# Altium project LCD-Controller.PrjPCB (part 1 of 2)
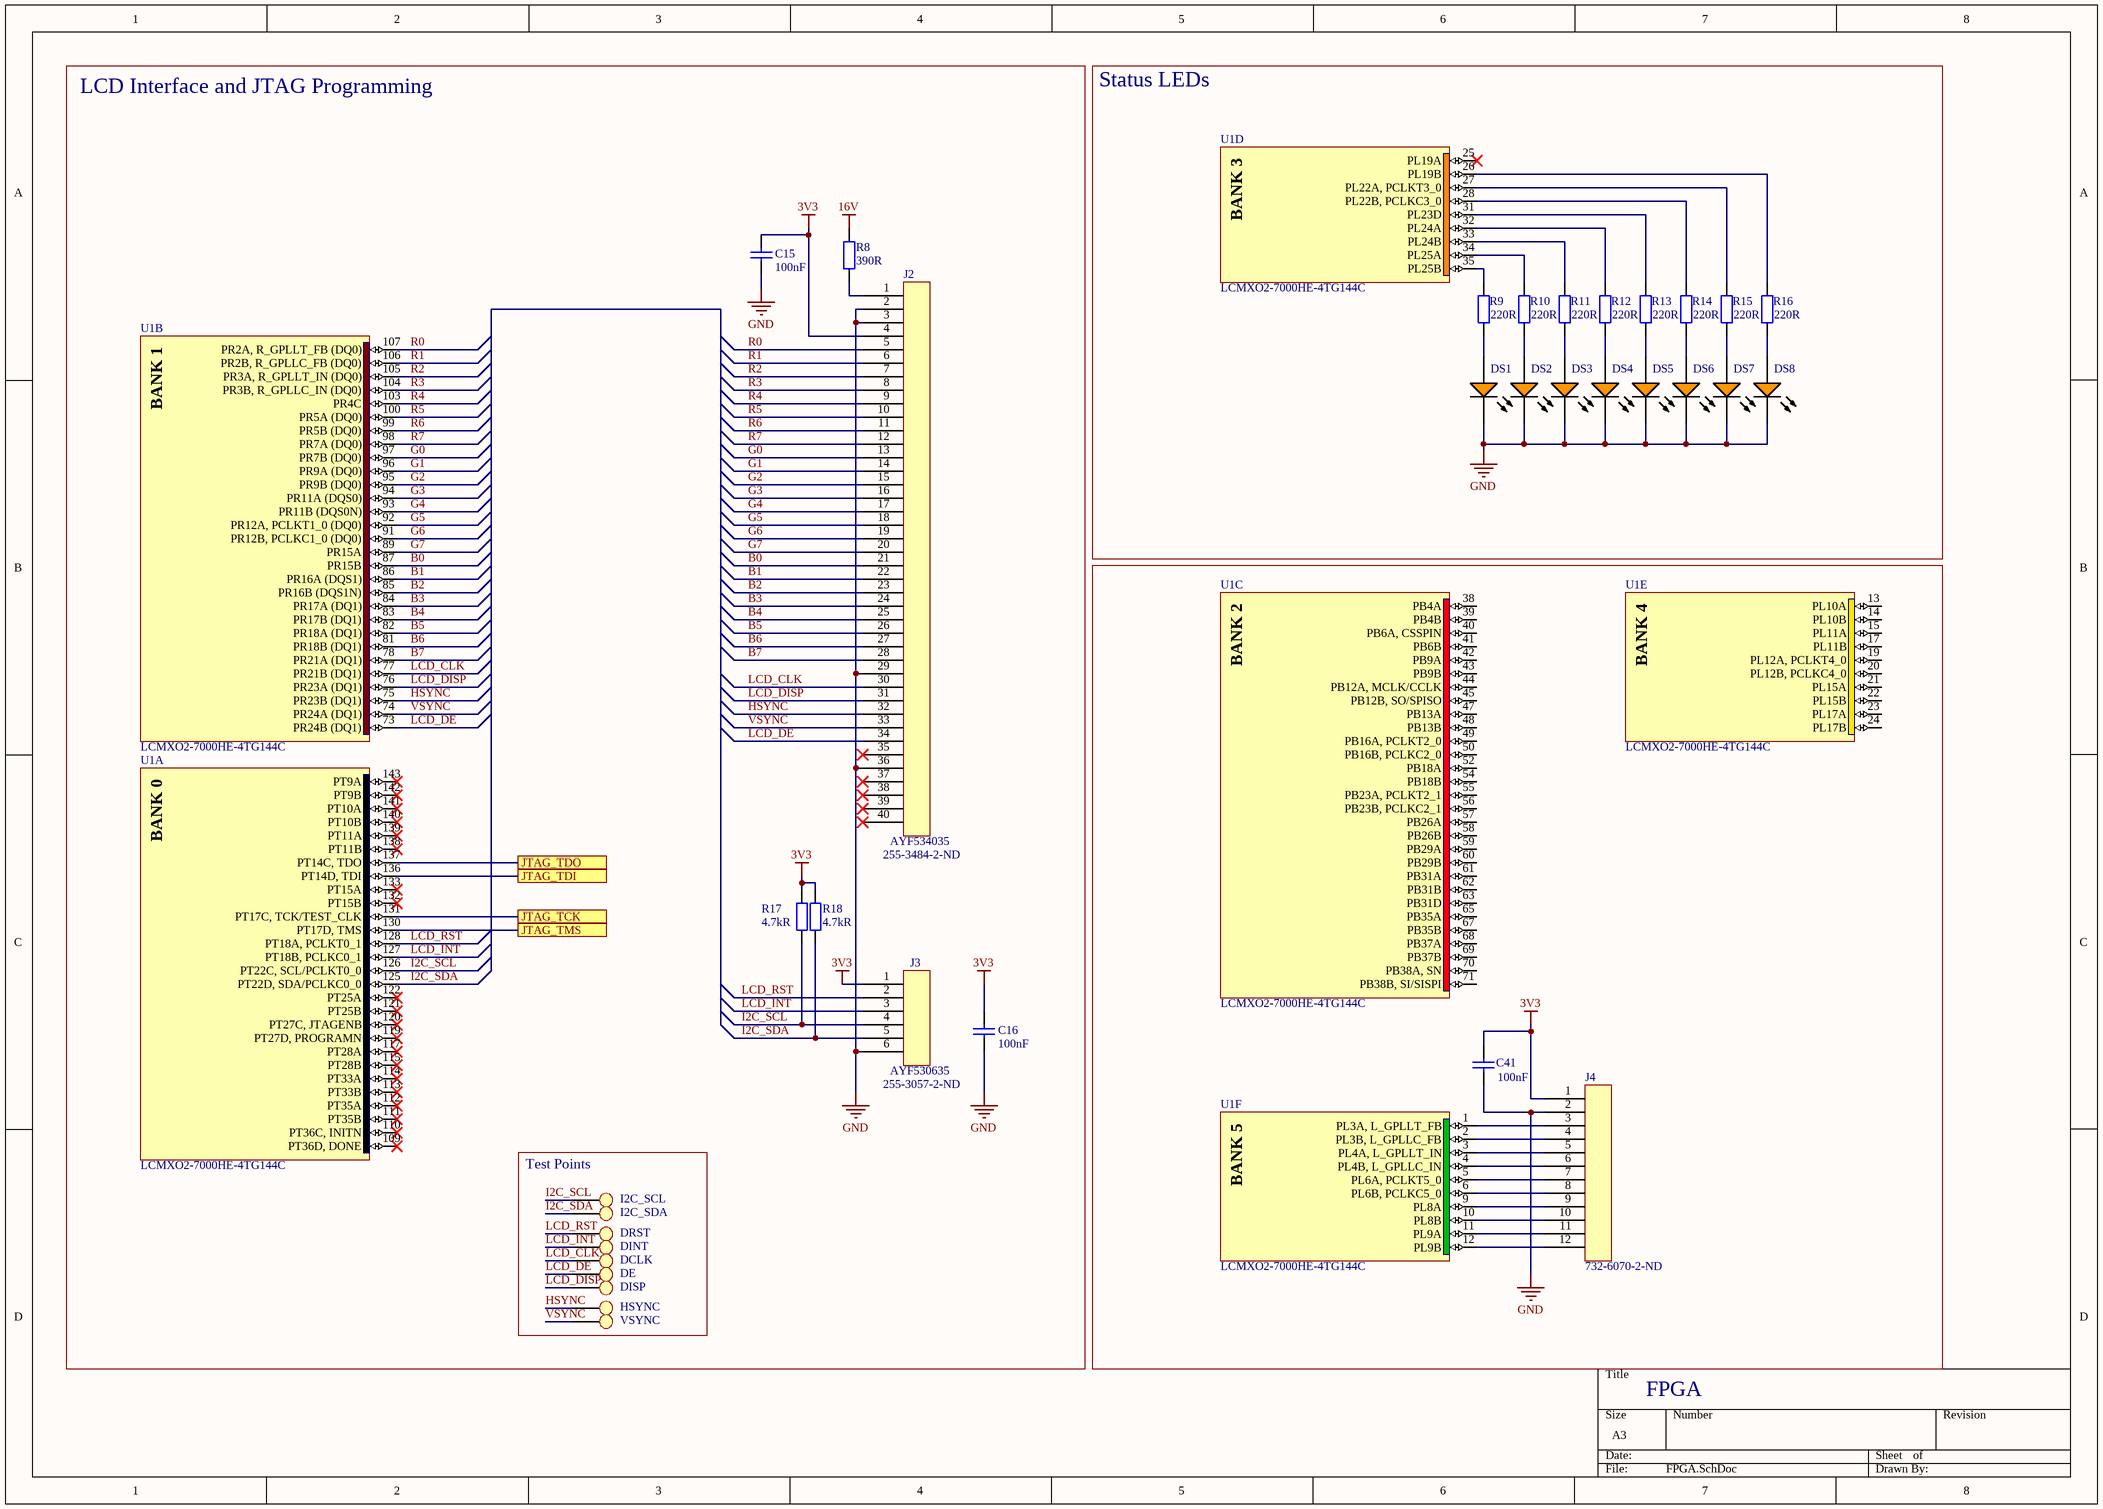
[diagram p0: FPGA.SchDoc]
3 sheets, 118 parts. Net scope: flat (ports and power ports of the same name join across sheets).
Board file: LCD-Controller.PcbDoc
Sheets:
  FPGA.SchDoc
  USB-to-JTAG.SchDoc
  Power-Management.SchDoc

## Sheet FPGA.SchDoc: FPGA
size A3

### Parts
C15  Capacitance: 100nF  [CAP_0402_imperial]  (hidden comment: C0402C104K4RACTU)
C16  Capacitance: 100nF  [CAP_0402_imperial]  (hidden comment: C0402C104K4RACTU)
C41  Capacitance: 100nF  [CAP_0402_imperial]  (hidden comment: C0402C104K4RAC-TU)
DCLK  TP  [TP_0.75DIA]  (value not drawn)
DE  TP  [TP_0.75DIA]  (value not drawn)
DINT  TP  [TP_0.75DIA]  (value not drawn)
DISP  TP  [TP_0.75DIA]  (value not drawn)
DRST  TP  [TP_0.75DIA]  (value not drawn)
DS1  APG1608SEKC/T  [KING-LED0603-25-ORANGE_V]  (value not drawn)
DS2  APG1608SEKC/T  [KING-LED0603-25-ORANGE_V]  (value not drawn)
DS3  APG1608SEKC/T  [KING-LED0603-25-ORANGE_V]  (value not drawn)
DS4  APG1608SEKC/T  [KING-LED0603-25-ORANGE_V]  (value not drawn)
DS5  APG1608SEKC/T  [KING-LED0603-25-ORANGE_V]  (value not drawn)
DS6  APG1608SEKC/T  [KING-LED0603-25-ORANGE_V]  (value not drawn)
DS7  APG1608SEKC/T  [KING-LED0603-25-ORANGE_V]  (value not drawn)
DS8  APG1608SEKC/T  [KING-LED0603-25-ORANGE_V]  (value not drawn)
HSYNC  TP  [TP_0.75DIA]  (value not drawn)
I2C_SCL  TP  [TP_0.75DIA]  (value not drawn)
I2C_SDA  TP  [TP_0.75DIA]  (value not drawn)
J2  AYF534035  Supplier Part Number 1: 255-3484-2-ND  [AYF534035]
J3  AYF530635  Supplier Part Number 1: 255-3057-2-ND  [AYF530635]
J4  Supplier Part Number 1: 732-6070-2-ND  [610112249121]  (hidden comment: 610112249121)
R8  Resistance: 390R  [RES_0603_imperial]  (hidden comment: 390R 1% 2512(6432))
R9  Resistance: 220R  [RES_0603_imperial]  (hidden comment: 220R 1% 0603(1608))
R10  Resistance: 220R  [RES_0603_imperial]  (hidden comment: 220R 1% 0603(1608))
R11  Resistance: 220R  [RES_0603_imperial]  (hidden comment: 220R 1% 0603(1608))
R12  Resistance: 220R  [RES_0603_imperial]  (hidden comment: 220R 1% 0603(1608))
R13  Resistance: 220R  [RES_0603_imperial]  (hidden comment: 220R 1% 0603(1608))
R14  Resistance: 220R  [RES_0603_imperial]  (hidden comment: 220R 1% 0603(1608))
R15  Resistance: 220R  [RES_0603_imperial]  (hidden comment: 220R 1% 0603(1608))
R16  Resistance: 220R  [RES_0603_imperial]  (hidden comment: 220R 1% 0603(1608))
R17  Resistance: 4.7kR  [RES_0603_imperial]  (hidden comment: 4K7 1% 0603(1608))
R18  Resistance: 4.7kR  [RES_0603_imperial]  (hidden comment: 4K7 1% 0603(1608))
U1  LCMXO2-7000HE-4TG144C  [TQFP144_L]  (parts A,B,C,D,E,F of 8)
VSYNC  TP  [TP_0.75DIA]  (value not drawn)

### Blocks framed on the sheet
LCD Interface and JTAG Programming: C15 C16 J2 J3 R8 R17 R18 U1
Status LEDs: DS1-DS8 R9-R16 U1
Test Points: DCLK DE DINT DISP DRST HSYNC I2C_SCL I2C_SDA VSYNC

### Ports
JTAG_TCK, JTAG_TDI, JTAG_TDO, JTAG_TMS

### Nets
3V3: C15.1 C16.1 C41.2 J2.4 J3.1 J4.1 R17.2 R18.2
16V: R8.2
GND: C15.2 C16.2 C41.1 DS1.2(K) DS2.2(K) DS3.2(K) DS4.2(K) DS5.2(K) DS6.2(K) DS7.2(K) DS8.2(K) J2.2 J2.3 J2.29 J2.36 J3.6 J4.2
B0: J2.21 U1.87(PR15B)
B1: J2.22 U1.86(PR16A_(DQS1))
B2: J2.23 U1.85(PR16B_(DQS1N))
B3: J2.24 U1.84(PR17A_(DQ1))
B4: J2.25 U1.83(PR17B_(DQ1))
B5: J2.26 U1.82(PR18A_(DQ1))
B6: J2.27 U1.81(PR18B_(DQ1))
B7: J2.28 U1.78(PR21A_(DQ1))
G0: J2.13 U1.97(PR7B_(DQ0))
G1: J2.14 U1.96(PR9A_(DQ0))
G2: J2.15 U1.95(PR9B_(DQ0))
G3: J2.16 U1.94(PR11A_(DQS0))
G4: J2.17 U1.93(PR11B_(DQS0N))
G5: J2.18 U1.92(PR12A,_PCLKT1_0_(DQ0))
G6: J2.19 U1.91(PR12B,_PCLKC1_0_(DQ0))
G7: J2.20 U1.89(PR15A)
HSYNC: HSYNC.1 J2.32 U1.75(PR23B_(DQ1))
I2C_SCL: I2C_SCL.1 J3.4 R17.1 U1.126(PT22C,_SCL/PCLKT0_0)
I2C_SDA: I2C_SDA.1 J3.5 R18.1 U1.125(PT22D,_SDA/PCLKC0_0)
LCD_CLK: DCLK.1 J2.30 U1.77(PR21B_(DQ1))
LCD_DE: DE.1 J2.34 U1.73(PR24B_(DQ1))
LCD_DISP: DISP.1 J2.31 U1.76(PR23A_(DQ1))
LCD_INT: DINT.1 J3.3 U1.127(PT18B,_PCLKC0_1)
LCD_RST: DRST.1 J3.2 U1.128(PT18A,_PCLKT0_1)
R0: J2.5 U1.107(PR2A,_R_GPLLT_FB_(DQ0))
R1: J2.6 U1.106(PR2B,_R_GPLLC_FB_(DQ0))
R2: J2.7 U1.105(PR3A,_R_GPLLT_IN_(DQ0))
R3: J2.8 U1.104(PR3B,_R_GPLLC_IN_(DQ0))
R4: J2.9 U1.103(PR4C)
R5: J2.10 U1.100(PR5A_(DQ0))
R6: J2.11 U1.99(PR5B_(DQ0))
R7: J2.12 U1.98(PR7A_(DQ0))
TCK: U1.131(PT17C,_TCK/TEST_CLK) ; port JTAG_TCK
TDI: U1.136(PT14D,_TDI) ; port JTAG_TDI
TDO: U1.137(PT14C,_TDO) ; port JTAG_TDO
TMS: U1.130(PT17D,_TMS) ; port JTAG_TMS
VSYNC: J2.33 U1.74(PR24A_(DQ1)) VSYNC.1
NetDS1_1: DS1.1(A) R9.1
NetDS2_1: DS2.1(A) R10.1
NetDS3_1: DS3.1(A) R11.1
NetDS4_1: DS4.1(A) R12.1
NetDS5_1: DS5.1(A) R13.1
NetDS6_1: DS6.1(A) R14.1
NetDS7_1: DS7.1(A) R15.1
NetDS8_1: DS8.1(A) R16.1
NetJ2_1: J2.1 R8.1
NetJ4_3: J4.3 U1.1(PL3A,_L_GPLLT_FB)
NetJ4_4: J4.4 U1.2(PL3B,_L_GPLLC_FB)
NetJ4_5: J4.5 U1.3(PL4A,_L_GPLLT_IN)
NetJ4_6: J4.6 U1.4(PL4B,_L_GPLLC_IN)
NetJ4_7: J4.7 U1.5(PL6A,_PCLKT5_0)
NetJ4_8: J4.8 U1.6(PL6B,_PCLKC5_0)
NetJ4_9: J4.9 U1.9(PL8A)
NetJ4_10: J4.10 U1.10(PL8B)
NetJ4_11: J4.11 U1.11(PL9A)
NetJ4_12: J4.12 U1.12(PL9B)
NetR9_2: R9.2 U1.35(PL25B)
NetR10_2: R10.2 U1.34(PL25A)
NetR11_2: R11.2 U1.33(PL24B)
NetR12_2: R12.2 U1.32(PL24A)
NetR13_2: R13.2 U1.31(PL23D)
NetR14_2: R14.2 U1.28(PL22B,_PCLKC3_0)
NetR15_2: R15.2 U1.27(PL22A,_PCLKT3_0)
NetR16_2: R16.2 U1.26(PL19B)

Not connected (* = marked no-connect by the designer): J2 35* 37* 38* 39* 40*; U1 13(PL10A) 14(PL10B) 15(PL11A) 17(PL11B) 19(PL12A,_PCLKT4_0) 20(PL12B,_PCLKC4_0) 21(PL15A) 22(PL15B) 23(PL17A) 24(PL17B) 25(PL19A)* 38(PB4A) 39(PB4B) 40(PB6A,_CSSPIN) 41(PB6B) 42(PB9A) 43(PB9B) 44(PB12A,_MCLK/CCLK) 45(PB12B,_SO/SPISO) 47(PB13A) 48(PB13B) 49(PB16A,_PCLKT2_0) 50(PB16B,_PCLKC2_0) 52(PB18A) 54(PB18B) 55(PB23A,_PCLKT2_1) 56(PB23B,_PCLKC2_1) 57(PB26A) 58(PB26B) 59(PB29A) 60(PB29B) 61(PB31A) 62(PB31B) 63(PB31D) 65(PB35A) 67(PB35B) 68(PB37A) 69(PB37B) 70(PB38A,_SN) 71(PB38B,_SI/SISPI) 109(PT36D,_DONE)* 110(PT36C,_INITN)* 111(PT35B)* 112(PT35A)* 113(PT33B)* 114(PT33A)* 115(PT28B)* 117(PT28A)* 119(PT27D,_PROGRAMN)* 120(PT27C,_JTAGENB)* 121(PT25B)* 122(PT25A)* 132(PT15B)* 133(PT15A)* 138(PT11B)* 139(PT11A)* 140(PT10B)* 141(PT10A)* 142(PT9B)* 143(PT9A)*

### Notes on the sheet
- (in symbol CMP-0111-00327-1, part A) BANK 0
- (in symbol CMP-0111-00327-1, part B) BANK 1
- (in symbol CMP-0111-00327-1, part C) BANK 2
- (in symbol CMP-0111-00327-1, part D) BANK 3
- (in symbol CMP-0111-00327-1, part E) BANK 4
- (in symbol CMP-0111-00327-1, part F) BANK 5

### Library data of the parts
C15 C16 C41 = C0402C104K4RAC-TU: CAP CER 0.1UF 16V X7R 0402; Manufacturer: KEMET; Dielectric Material: Ceramic; Dissipation Factor: 3.5%; Tolerance: 10%; Supplier 1: Digi-Key; Manufacturer Part Number: C0402C104K4RAC-TU; Stock 1: 0; Mount: Surface Mount,PCB; Case/Package: 0402; Number of Pins: 2; Case Code (Metric): 1005; Case Code (Imperial): 0402; Contact Plating: Tin,Matte; Min Operating Temperature: -55°C; Max Operating Temperature: 125°C; Packaging: Tape and Reel; Voltage Rating (DC): 16V; Dielectric: X7R; Voltage Rating: 16V; Package Quantity: 1; Termination: SMD/SMT; Length: 1mm; Height: 0.5mm; Width: 0.02inch; Depth: 0.5mm; Thickness: 0.022inch; Lead Pitch: 0.3mm; Radiation Hardening: No; REACH SVHC: No SVHC; ComponentLink1URL: https://datasheet.ciiva.com/28645/1851736-28645381.pdf; ComponentLink1Description: https://datasheet.ciiva.com/28645/1851736-28645381.pdf; ComponentLink2URL: https://datasheet.ciiva.com/5418/kem-c1002-x7r-smd-5418136.pdf; ComponentLink2Description: https://datasheet.ciiva.com/5418/kem-c1002-x7r-smd-5418136.pdf; ComponentLink3URL: https://datasheet.ciiva.com/14586/70095383-14586056.pdf; ComponentLink3Description: https://datasheet.ciiva.com/14586/70095383-14586056.pdf; ComponentLink4URL: https://datasheet.ciiva.com/18100/getdatasheetpartid-37082-18100986.pdf; ComponentLink4Description: https://datasheet.ciiva.com/18100/getdatasheetpartid-37082-18100986.pdf; ComponentLink5URL: https://datasheet.ciiva.com/14603/70095383-14603039.pdf; ComponentLink5Description: https://datasheet.ciiva.com/14603/70095383-14603039.pdf; Supplier Part Number 1: 399-3521-6-ND; Voltage: 16V
DS1-DS8 = CMP-0239-00002-1: LED, SMT, 0603(1608), 0.25mm Tthickness, Super Bright Orange; Forward Current: 30 mA; Power Dissipation: 75 mW; Reverse Voltage: 5 V; Packing: Reel; PackageDescription: 2-Pin SMT LED, 1.6 x 0.8 mm Body, 0.25mm Thickness; ComponentLink1URL: http://www.kingbrightusa.com/; PackageVersion: Rev. 4A, 12/2011; Storage Temperature: -40 to 85 degC; PartNumber: APG1608SEKC/T; Mounting Technology: Surface Mount; ComponentLink2Description: Datasheet; DatasheetVersion: Rev. 4A, 12/2011; ComponentLink2URL: http://www.kingbrightusa.com/images/catalog/SPEC/APG1608SEKC-T.pdf; PackageReference: LED0603-25-ORANGE; ComponentLink1Description: Manufacturer URL
J2 = AYF534035: CONN FFC FPC 40POS 0.50MM R/A; Manufacturer: Panasonic; Actuator Material: Polymer,Liquid Crystal Polymer; Current Rating: 500mA; Voltage Rating: 50V; Number of Positions: 40; Contact Location: Dual; Pitch: 0.02inch; Supplier 1: Digi-Key; Manufacturer Part Number: AYF534035; Stock 1: 10000; Pricing 1: 5000=1.1438 (USD); Mount: Surface Mount; Contact Material: Copper Alloy; Contact Plating: Gold; Housing Material: Polymer; Min Operating Temperature: -55°C; Max Operating Temperature: 85°C; Packaging: Tape and Reel; Termination: Solder; Package Quantity: 1000; Flammability Rating: UL94 V-0; ComponentLink1URL: http://components.arrow.com/part/dataview/0323_03238277; ComponentLink1Description: http://components.arrow.com/part/dataview/0323_03238277; ComponentLink2URL: http://www.mouser.com/ds/2/315/Panasonic_Y5B_Y5BW%20Series-1076217.pdf; ComponentLink2Description: http://www.mouser.com/ds/2/315/Panasonic_Y5B_Y5BW%20Series-1076217.pdf; ComponentLink3URL: http://www3.panasonic.biz/ac/e_download/control/connector/fpc-ffc/catalog/con_eng_y5bw.pdf; ComponentLink3Description: http://www3.panasonic.biz/ac/e_download/control/connector/fpc-ffc/catalog/con_eng_y5bw.pdf
J3 = AYF530635: CONN FFC FPC 6POS 0.50MM R/A; Manufacturer: Panasonic; Actuator Material: Polymer,Liquid Crystal Polymer; Current Rating: 500mA; Voltage Rating: 50V; Number of Positions: 6; Contact Resistance: 80mR; Max Voltage Rating (DC): 5.05kV; Contact Location: Dual; Pitch: 0.5mm; Supplier 1: Digi-Key; Manufacturer Part Number: AYF530635; Stock 1: 0; Pricing 1: 5000=0.798, 10000=0.78 (USD); Mount: Surface Mount; Contact Material: Copper Alloy; Contact Plating: Gold; Housing Material: Polymer; Min Operating Temperature: -55°C; Max Operating Temperature: 85°C; Number of Rows: 1; Packaging: Tape and Reel; Termination: Solder; Number of Contacts: 6; Orientation: Right Angle; Package Quantity: 1; Radiation Hardening: No; Flammability Rating: UL94 V-0; ComponentLink1URL: https://datasheet.ciiva.com/15249/eng-y5bw-15249222.pdf; ComponentLink1Description: https://datasheet.ciiva.com/15249/eng-y5bw-15249222.pdf
J4 = 610112249121: Pin header 12P, 610112249121, Würth Elektronik; Manufacturer: Wurth Electronics; Current Rating: 3A; Number of Positions: 12; Gender: Male; Connector Type: Male Pin; Pitch: 0.1inch; Supplier 1: Digi-Key; Manufacturer Part Number: 610112249121; Stock 1: 0; Pricing 1: 350=1.884, 700=1.64901 (USD); Mount: Surface Mount; Contact Material: Copper Alloy; Colour: Black; Contact Plating: Gold; Packaging: Cut Tape; Number of Rows: 2; Termination: Solder; Number of Contacts: 12; Row Spacing: 0.1inch; Contact Mating Length: 0.236inch; REACH SVHC: Unknown; ComponentLink1URL: http://katalog.we-online.de/em/datasheet/6101xx249121.pdf; ComponentLink1Description: http://katalog.we-online.de/em/datasheet/6101xx249121.pdf; ComponentLink2URL: https://www.distrelec.bizhttp://katalog.we-online.de/em/datasheet/6101xx249121.pdf?mime=application%2Fpdf; ComponentLink2Description: https://www.distrelec.bizhttp://katalog.we-online.de/em/datasheet/6101xx249121.pdf?mime=application%2Fpdf; ComponentLink3URL: http://www.farnell.com/cad/1889791.pdf; ComponentLink3Description: http://www.farnell.com/cad/1889791.pdf
R8 = ERA3AEB391V: PANASONIC ELECTRONIC COMPONENTS         ERA3AEB391V             SMD Chip Resistor, Thin Film, 390 ohm, 75 V, 0603 [1608 Metric], 100 mW,  0.1%, ERA Series; Voltage Rating: 75V; Temperature Coefficient: 25ppm/°C; Power Rating: 100mW; Tolerance: 0.1%; Supplier 1: Digi-Key; Manufacturer: Panasonic; Manufacturer Part Number: ERA3AEB391V; Stock 1: 37643; Pricing 1: 1=0.41, 10=0.346, 100=0.1351, 1000=0.05655, 2500=0.05184 (USD); Mount: Surface Mount; Case/Package: 0603; Number of Pins: 2; Case Code (Metric): 1608; Case Code (Imperial): 0603; Contact Plating: Tin; Min Operating Temperature: -55°C; Max Operating Temperature: 155°C; Packaging: Tape and Reel; Package Quantity: 1; Termination: Solder; Voltage Rating (DC): 75V; Composition: Thin Film; Military Standard: Not; Number of Terminations: 2; Max Power Dissipation: 100mW; Length: 1.6mm; Height: 0.45mm; Width: 0.8mm; Depth: 0.8mm; Radiation Hardening: No; REACH SVHC: No SVHC; Lead Free: Lead Free; ComponentLink1URL: https://datasheet.ciiva.com/6001/485442-6001685.pdf; ComponentLink1Description: https://datasheet.ciiva.com/6001/485442-6001685.pdf; ComponentLink2URL: https://datasheet.ciiva.com/6001/485442-6001686.pdf; ComponentLink2Description: https://datasheet.ciiva.com/6001/485442-6001686.pdf; ComponentLink3URL: https://datasheet.ciiva.com/9182/aoa0000ce26-9182342.pdf; ComponentLink3Description: https://datasheet.ciiva.com/9182/aoa0000ce26-9182342.pdf; ComponentLink4URL: https://datasheet.ciiva.com/48425/era-eng-tds-48425462.pdf; ComponentLink4Description: https://datasheet.ciiva.com/48425/era-eng-tds-48425462.pdf; ComponentLink5URL: https://datasheet.ciiva.com/7909/485442-7909096.pdf; ComponentLink5Description: https://datasheet.ciiva.com/7909/485442-7909096.pdf; ComponentLink6URL: https://datasheet.ciiva.com/7909/485442-7909097.pdf; ComponentLink6Description: https://datasheet.ciiva.com/7909/485442-7909097.pdf; ComponentLink7URL: https://datasheet.ciiva.com/7909/485442-7909098.pdf; ComponentLink7Description: https://datasheet.ciiva.com/7909/485442-7909098.pdf; ComponentLink8URL: https://datasheet.ciiva.com/22737/39837-22737548.pdf; ComponentLink8Description: https://datasheet.ciiva.com/22737/39837-22737548.pdf; ComponentLink9URL: https://datasheet.ciiva.com/11808/0900766b80fe20f7-11808046.pdf; ComponentLink9Description: https://datasheet.ciiva.com/11808/0900766b80fe20f7-11808046.pdf; ComponentLink10URL: https://datasheet.ciiva.com/17205/aoa0000ce26-17205855.pdf; ComponentLink10Description: https://datasheet.ciiva.com/17205/aoa0000ce26-17205855.pdf; ComponentLink11URL: https://datasheet.ciiva.com/29183/450555-da-01-en-widerstand-0603-era-29183689.pdf; ComponentLink11Description: https://datasheet.ciiva.com/29183/450555-da-01-en-widerstand-0603-era-29183689.pdf; Supplier Part Number 1: P390DBDKR-ND
R9-R16 = ERA-3AEB221V: Res Thin Film 0603 220 Ohm 0.1% 1/10W ±25ppm/C Molded SMD Punched Carrier T/R; Manufacturer: Panasonic; Voltage Rating: 75V; Temperature Coefficient: 25ppm/°C; Power Rating: 100mW; Tolerance: 0.1%; Supplier 1: Digi-Key; Manufacturer Part Number: ERA-3AEB221V; Stock 1: 240; Pricing 1: 1=0.41, 10=0.346, 100=0.1351, 1000=0.05655, 2500=0.05184 (USD); Mount: Surface Mount; Case/Package: 0603; Number of Pins: 2; Case Code (Metric): 1608; Case Code (Imperial): 0603; Contact Plating: Tin; Min Operating Temperature: -55°C; Max Operating Temperature: 155°C; Packaging: Tape and Reel; Package Quantity: 1; Termination: SMD/SMT; Voltage Rating (DC): 75V; Military Standard: Not; Max Power Dissipation: 100mW; Composition: Metal Film,Thin Film; Number of Terminations: 2; Features: Automotive AEC-Q200; Length: 1.6mm; Height: 0.45mm; Width: 0.8mm; Depth: 0.8mm; Radiation Hardening: No; REACH SVHC: No SVHC; Lead Free: Lead Free; ComponentLink1URL: https://datasheet.ciiva.com/30089/54aoa0000ce26-30089206.pdf; ComponentLink1Description: https://datasheet.ciiva.com/30089/54aoa0000ce26-30089206.pdf; ComponentLink2URL: https://datasheet.ciiva.com/11808/0900766b80fe20f7-11808055.pdf; ComponentLink2Description: https://datasheet.ciiva.com/11808/0900766b80fe20f7-11808055.pdf; ComponentLink3URL: https://datasheet.ciiva.com/48530/era-eng-tds-48530567.pdf; ComponentLink3Description: https://datasheet.ciiva.com/48530/era-eng-tds-48530567.pdf; ComponentLink4URL: https://datasheet.ciiva.com/9117/aoa0000ce26-9117624.pdf; ComponentLink4Description: https://datasheet.ciiva.com/9117/aoa0000ce26-9117624.pdf; ComponentLink5URL: https://datasheet.ciiva.com/22739/485442-22739289.pdf; ComponentLink5Description: https://datasheet.ciiva.com/22739/485442-22739289.pdf; ComponentLink6URL: https://datasheet.ciiva.com/7886/485442-7886586.pdf; ComponentLink6Description: https://datasheet.ciiva.com/7886/485442-7886586.pdf; ComponentLink7URL: https://datasheet.ciiva.com/9184/aoa0000ce26-9184316.pdf; ComponentLink7Description: https://datasheet.ciiva.com/9184/aoa0000ce26-9184316.pdf; ComponentLink8URL: https://datasheet.ciiva.com/43455/485442-43455212.pdf; ComponentLink8Description: https://datasheet.ciiva.com/43455/485442-43455212.pdf; ComponentLink9URL: https://datasheet.ciiva.com/6000/485442-6000910.pdf; ComponentLink9Description: https://datasheet.ciiva.com/6000/485442-6000910.pdf; ComponentLink10URL: https://datasheet.ciiva.com/17206/aoa0000ce26-17206814.pdf; ComponentLink10Description: https://datasheet.ciiva.com/17206/aoa0000ce26-17206814.pdf; ComponentLink11URL: https://datasheet.ciiva.com/48425/era-eng-tds-48425439.pdf; ComponentLink11Description: https://datasheet.ciiva.com/48425/era-eng-tds-48425439.pdf; ComponentLink12URL: https://datasheet.ciiva.com/29183/450451-da-01-en-widerstand-0603-era-29183676.pdf; ComponentLink12Description: https://datasheet.ciiva.com/29183/450451-da-01-en-widerstand-0603-era-29183676.pdf; Supplier Part Number 1: P220DBDKR-ND
R17 R18 = ERA-3AEB472V: Res Thin Film 0603 4.7K Ohm 0.1% 0.1W(1/10W) ±25ppm/C Molded SMD Automotive Punched T/R; Manufacturer: Panasonic; Power Rating: 100mW; Voltage Rating: 75V; Temperature Coefficient: 25ppm/°C; Tolerance: 0.1%; Supplier 1: Digi-Key; Manufacturer Part Number: ERA-3AEB472V; Stock 1: 123784; Pricing 1: 1=0.41, 10=0.346, 100=0.1351, 1000=0.05655, 2500=0.05184 (USD); Mount: Surface Mount; Case/Package: 0603; Number of Pins: 2; Case Code (Metric): 1608; Case Code (Imperial): 0603; Contact Plating: Tin; Min Operating Temperature: -55°C; Max Operating Temperature: 155°C; Packaging: Tape and Reel; Package Quantity: 5000; Termination: SMD/SMT; Max Power Dissipation: 100mW; Composition: Metal Film,Thin Film; Military Standard: Not; Voltage Rating (DC): 75V; Number of Terminations: 2; Working Voltage: 75V; Length: 1.6mm; Height: 0.45mm; Depth: 0.8mm; Width: 0.8mm; Radiation Hardening: No; REACH SVHC: No SVHC; Lead Free: Lead Free; ComponentLink1URL: https://datasheet.ciiva.com/22743/485442-22743061.pdf; ComponentLink1Description: https://datasheet.ciiva.com/22743/485442-22743061.pdf; ComponentLink2URL: https://datasheet.ciiva.com/46422/485442-46422693.pdf; ComponentLink2Description: https://datasheet.ciiva.com/46422/485442-46422693.pdf; ComponentLink3URL: https://datasheet.ciiva.com/11808/0900766b80fe20f7-11808039.pdf; ComponentLink3Description: https://datasheet.ciiva.com/11808/0900766b80fe20f7-11808039.pdf; ComponentLink4URL: https://datasheet.ciiva.com/9116/aoa0000ce26-9116681.pdf; ComponentLink4Description: https://datasheet.ciiva.com/9116/aoa0000ce26-9116681.pdf; ComponentLink5URL: https://datasheet.ciiva.com/22781/485442-22781497.pdf; ComponentLink5Description: https://datasheet.ciiva.com/22781/485442-22781497.pdf; ComponentLink6URL: https://datasheet.ciiva.com/9117/aoa0000ce26-9117707.pdf; ComponentLink6Description: https://datasheet.ciiva.com/9117/aoa0000ce26-9117707.pdf; ComponentLink7URL: https://datasheet.ciiva.com/43455/485442-43455227.pdf; ComponentLink7Description: https://datasheet.ciiva.com/43455/485442-43455227.pdf; ComponentLink8URL: https://datasheet.ciiva.com/16772/70068849-16772572.pdf; ComponentLink8Description: https://datasheet.ciiva.com/16772/70068849-16772572.pdf; ComponentLink9URL: https://datasheet.ciiva.com/48425/era-eng-tds-48425470.pdf; ComponentLink9Description: https://datasheet.ciiva.com/48425/era-eng-tds-48425470.pdf; ComponentLink10URL: https://datasheet.ciiva.com/30078/54aoa0000ce26-30078815.pdf; ComponentLink10Description: https://datasheet.ciiva.com/30078/54aoa0000ce26-30078815.pdf; ComponentLink11URL: https://datasheet.ciiva.com/29183/451124-da-01-en-widerstand-0603-era-29183789.pdf; ComponentLink11Description: https://datasheet.ciiva.com/29183/451124-da-01-en-widerstand-0603-era-29183789.pdf; Supplier Part Number 1: P4.7KDBDKR-ND
U1 = CMP-0111-00327-1: MachXO2 High Performance CPLD with 6864 LUTs, 1.2V, 144-pin TQFP, Speed Grade-4, Commercial Grade, Halogen Free (RoHS); Code_JEDEC: MS-026-BFB; PackageDescription: 144-Pin Thin Quad Flat Pack (TQFP144); PackageVersion: ver02.6, Nov-2010; DatasheetVersion: ver01.0, Nov-2010; PackageReference: TQFP144; PartId: 1

## Sheet USB-to-JTAG.SchDoc: USB to JTAG
size A4; DrawnBy: Fred Vatnsdal; SheetNumber: 1
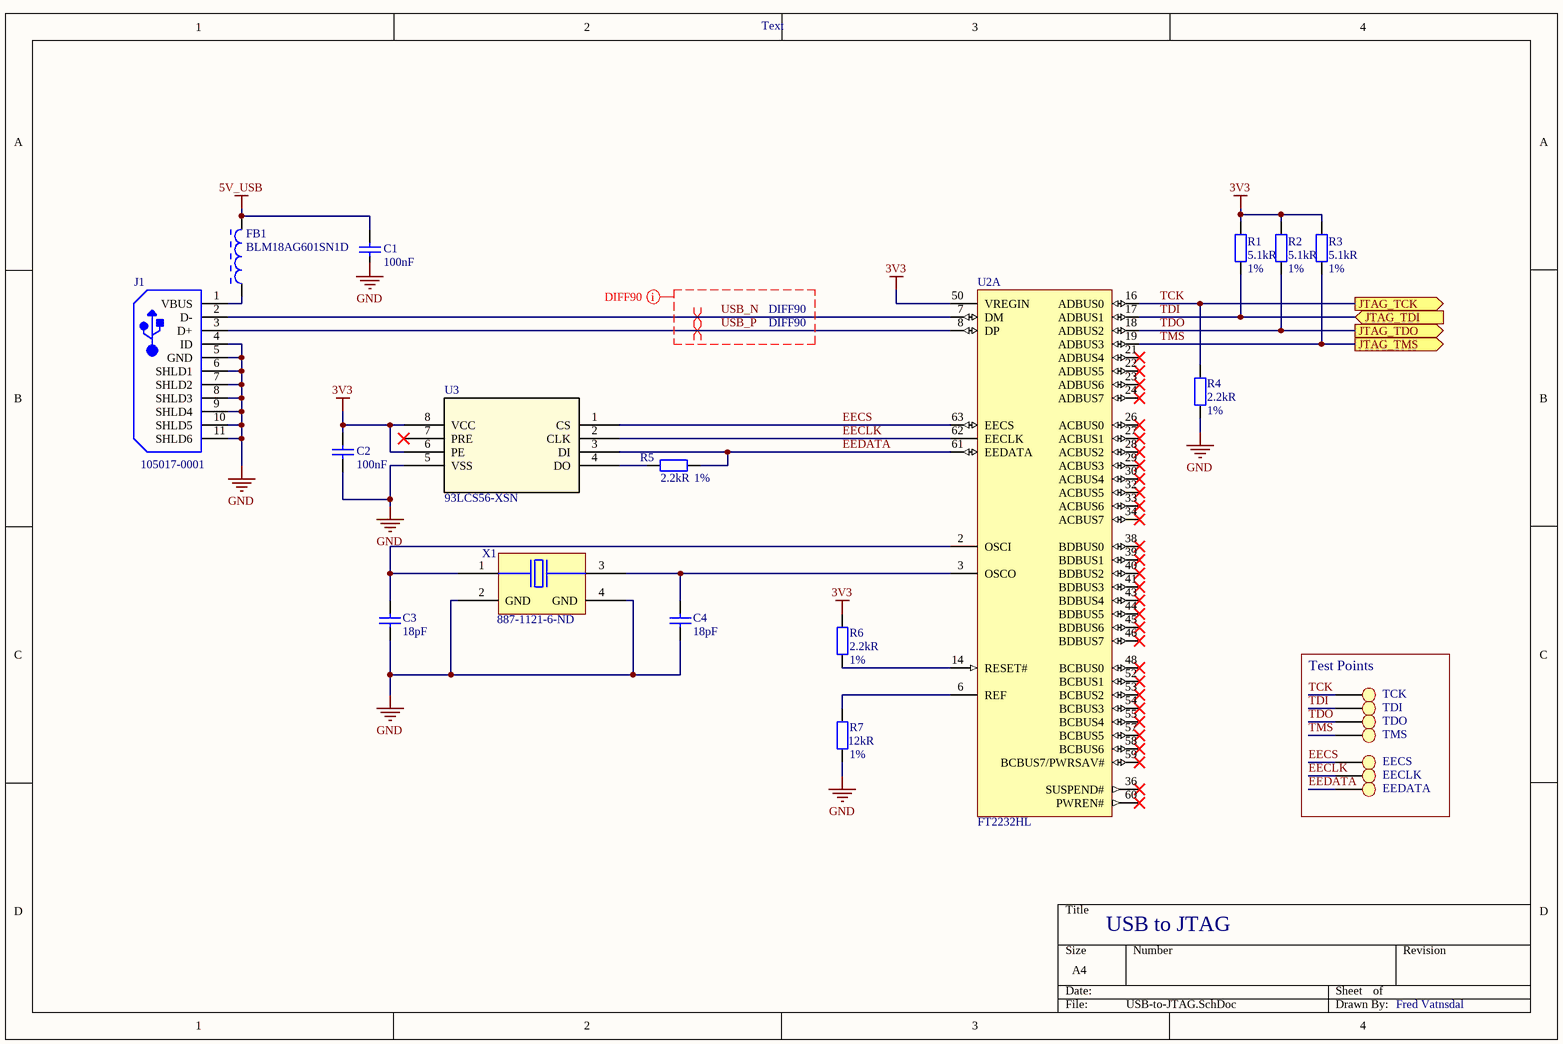
[diagram p1: USB-to-JTAG.SchDoc]

### Parts
C1  Capacitance: 100nF  [CAP_0402_imperial]  (hidden comment: C0402C104K4RACTU)
C2  Capacitance: 100nF  [CAP_0402_imperial]  (hidden comment: C0402C104K4RACTU)
C3  Capacitance: 18pF  [CAP_0402_imperial]  (hidden comment: C0402C180K3GACTU)
C4  Capacitance: 18pF  [CAP_0402_imperial]  (hidden comment: C0402C180K3GACTU)
EECLK  TP  [TP_0.75DIA]  (value not drawn)
EECS  TP  [TP_0.75DIA]  (value not drawn)
EEDATA  TP  [TP_0.75DIA]  (value not drawn)
FB1  BLM18AG601SN1D  [MURA-BLM18-F-H1-CHIP-2_V]
J1  105017-0001  [USB-MICRO-B_V]
R1  Tolerance: 1%  Resistance: 5.1kR  [RES_0402_imperial]  (hidden comment: 5K1 1% 0402(1005))
R2  Tolerance: 1%  Resistance: 5.1kR  [RES_0402_imperial]  (hidden comment: 5K1 1% 0402(1005))
R3  Tolerance: 1%  Resistance: 5.1kR  [RES_0402_imperial]  (hidden comment: 5K1 1% 0402(1005))
R4  Tolerance: 1%  Resistance: 2.2kR  [RES_0402_imperial]  (hidden comment: 2K2 1% 0402(1005))
R5  Tolerance: 1%  Resistance: 2.2kR  [RES_0402_imperial]  (hidden comment: 2K2 1% 0402(1005))
R6  Tolerance: 1%  Resistance: 2.2kR  [RES_0402_imperial]  (hidden comment: 2K2 1% 0402(1005))
R7  Resistance: 12kR  Tolerance: 1%  [RES_0402_imperial]  (hidden comment: RC0402FR-0712KL)
TCK  TP  [TP_0.75DIA]  (value not drawn)
TDI  TP  [TP_0.75DIA]  (value not drawn)
TDO  TP  [TP_0.75DIA]  (value not drawn)
TMS  TP  [TP_0.75DIA]  (value not drawn)
U2  FT2232HL  [FTDI-LQFP-64_L]  (part A of 2)
U3  93LCS56-XSN  [SOIC8-N_MC]
X1  Supplier Part Number 1: 887-1121-6-ND  [7M-12.000MAAJ-T]  (hidden comment: 7M-12.000MAAJ-T)

### Blocks framed on the sheet
Test Points: EECLK EECS EEDATA TCK TDI TDO TMS

### Ports
JTAG_TCK (out), JTAG_TDI (in), JTAG_TDO (out), JTAG_TMS (out)

### Nets
3V3: C2.1 R1.2 R2.2 R3.2 R6.2 U2.50(VREGIN) U3.6(PE) U3.8(VCC)
5V_USB: C1.1 FB1.2
GND: C2.2 C3.2 C4.2 J1.4(ID) J1.5(GND) J1.6(SHLD1) J1.7(SHLD2) J1.8(SHLD3) J1.9(SHLD4) J1.10(SHLD5) J1.11(SHLD6) R4.1 R7.1 U3.5(VSS) X1.2(GND) X1.4(GND)
EECLK: EECLK.1 U2.62(EECLK) U3.2(CLK)
EECS: EECS.1 U2.63(EECS) U3.1(CS)
EEDATA: EEDATA.1 R5.1 U2.61(EEDATA) U3.3(DI)
TCK: R4.2 TCK.1 U2.16(ADBUS0) ; port JTAG_TCK
TDI: R1.1 TDI.1 U2.17(ADBUS1) ; port JTAG_TDI
TDO: R2.1 TDO.1 U2.18(ADBUS2) ; port JTAG_TDO
TMS: R3.1 TMS.1 U2.19(ADBUS3) ; port JTAG_TMS
USB_N: J1.2(D-) U2.7(DM)
USB_P: J1.3(D+) U2.8(DP)
NetC3_1: C3.1 U2.2(OSCI) X1.1
NetC4_1: C4.1 U2.3(OSCO) X1.3
NetFB1_1: FB1.1 J1.1(VBUS)
NetR5_2: R5.2 U3.4(DO)
NetR6_1: R6.1 U2.14(RESET#)
NetR7_2: R7.2 U2.6(REF)

Not connected (* = marked no-connect by the designer): C1 2; U2 21(ADBUS4)* 22(ADBUS5)* 23(ADBUS6)* 24(ADBUS7)* 26(ACBUS0)* 27(ACBUS1)* 28(ACBUS2)* 29(ACBUS3)* 30(ACBUS4)* 32(ACBUS5)* 33(ACBUS6)* 34(ACBUS7)* 36(SUSPEND#)* 38(BDBUS0)* 39(BDBUS1)* 40(BDBUS2)* 41(BDBUS3)* 43(BDBUS4)* 44(BDBUS5)* 45(BDBUS6)* 46(BDBUS7)* 48(BCBUS0)* 52(BCBUS1)* 53(BCBUS2)* 54(BCBUS3)* 55(BCBUS4)* 57(BCBUS5)* 58(BCBUS6)* 59(BCBUS7/PWRSAV#)* 60(PWREN#)*; U3 7(PRE)*

### Layout directives
differential pair: USB_N, USB_P
net class DIFF90: USB_N, USB_P

### Notes on the sheet
- Text
- DIFF90
- Labels drawn without touching a wire or pin: GND

### Library data of the parts
C1 C2 = C0402C104K4RAC-TU: as C15 on sheet FPGA; Supplier 1: Digi-Key; Manufacturer Part Number: C0402C104K4RAC-TU; Stock 1: 0; Mount: Surface Mount,PCB; Case/Package: 0402; Number of Pins: 2; Case Code (Metric): 1005; Case Code (Imperial): 0402; Contact Plating: Tin,Matte; Min Operating Temperature: -55°C; Max Operating Temperature: 125°C; Packaging: Tape and Reel; Voltage Rating (DC): 16V; Dielectric: X7R; Voltage Rating: 16V; Package Quantity: 1; Termination: SMD/SMT; Length: 1mm; Height: 0.5mm; Width: 0.02inch; Depth: 0.5mm; Thickness: 0.022inch; Lead Pitch: 0.3mm; Radiation Hardening: No; REACH SVHC: No SVHC; ComponentLink1URL: https://datasheet.ciiva.com/28645/1851736-28645381.pdf; ComponentLink1Description: https://datasheet.ciiva.com/28645/1851736-28645381.pdf; ComponentLink2URL: https://datasheet.ciiva.com/5418/kem-c1002-x7r-smd-5418136.pdf; ComponentLink2Description: https://datasheet.ciiva.com/5418/kem-c1002-x7r-smd-5418136.pdf; ComponentLink3URL: https://datasheet.ciiva.com/14586/70095383-14586056.pdf; ComponentLink3Description: https://datasheet.ciiva.com/14586/70095383-14586056.pdf; ComponentLink4URL: https://datasheet.ciiva.com/18100/getdatasheetpartid-37082-18100986.pdf; ComponentLink4Description: https://datasheet.ciiva.com/18100/getdatasheetpartid-37082-18100986.pdf; ComponentLink5URL: https://datasheet.ciiva.com/14603/70095383-14603039.pdf; ComponentLink5Description: https://datasheet.ciiva.com/14603/70095383-14603039.pdf; Supplier Part Number 1: 399-3521-6-ND; Voltage: 16V
C3 C4 = C0402C180K3GACTU: CAP CER 18PF 25V NP0 0402; Manufacturer: KEMET; Dielectric Material: Ceramic; Dielectric: C0G; Dissipation Factor: 0.1%; Tolerance: 10%; Supplier 1: Digi-Key; Manufacturer Part Number: C0402C180K3GACTU; Stock 1: 0; Mount: Surface Mount; Case/Package: 0402; Case Code (Metric): 1005; Case Code (Imperial): 0402; Min Operating Temperature: -55°C; Max Operating Temperature: 125°C; Packaging: Tape and Reel; Voltage Rating (DC): 25V; Package Quantity: 10000; Termination: SMD/SMT; Length: 1mm; Height: 0.5mm; Depth: 0.5mm; Width: 0.02inch; Thickness: 0.022inch; Lead Pitch: 0.3mm; Lead Free: Lead Free; ComponentLink1URL: https://datasheet.ciiva.com/13376/kem-c1003-c0g-smd-356956-13376925.pdf; ComponentLink1Description: https://datasheet.ciiva.com/13376/kem-c1003-c0g-smd-356956-13376925.pdf; Supplier Part Number 1: C0402C180K3GACTU-ND; Voltage Rating: 25V
FB1 = CMP-0686-00436-2: Chip Ferrite Bead for General Use, 600 Ohm, 500 mA, -55 to 125 degC, 1.6 x 0.8 x 0.95 mm SMD, Tape and Reel; Manufacturer: Murata; DC Resistance: 0.38 Ohm Max.; Impedance (at 100 MHz): 600 Ohm +/- 25%; Rated Current: 500 mA; ComponentLink3Description: Package Specification; ComponentLink1Description: Manufacturer URL; ComponentLink1URL: http://www.murata.com/; DatasheetVersion: 08/2013; ComponentLink2URL: http://www.murata.com/products/catalog/pdf/c31e.pdf; PackageReference: BLM18_H950-2; PackageDescription: 2-Pin Chip, Body 1.6 x 0.8 mm; PartNumber: BLM18AG601SN1D; Mounting Technology: Surface Mount; ComponentLink2Description: Datasheet; Packing: Tape and Reel; ComponentLink3URL: http://www.murata.com/products/catalog/pdf/c31e.pdf; Operating Temperature Range: -55 to 125 degC
J1 = CMP-2000-05827-1: Micro-USB B Receptacle, Right Angle, Bottom Mount, Surface Mount, with Solder Tabs, -30 to 85 degC, 5-Pin USB, RoHS, Tape and Reel; Manufacturer: Molex; Featured Product: Micro-USBConnectorsUSBConnectors; Other Names: WM1399DKR; Package Version: Rev. F, 12/2012; Number of Contacts: 5; Connector Type: USB-microB; Catalog Drawings: 1050170001; 3D Model: 105017-0001.stp; Mating Products: WM17145-ND-CABLEMICROUSBBTOSTDA1.0MWM17147-ND-CABLEMICROUSBBTOSTDA2.0MWM17146-ND-CABLEMICROUSBBTOSTDA1.5M; PCN Assembly/Origin: ResinSupplier21/Oct/2015; Voltage - Max: 30V; Online Catalog: Molex-MicroUSB; Manufacturer URL: http://www.molex.com/; Package Description: 5-Leads USB, Micro B, Body 7.5 x 5 mm, Pitch 0.65 mm; Datasheet URL: http://www.molex.com/elqNow/elqRedir.htm?ref=http://www.molex.com/webdocs/datasheets/pdf/en-us/1050170001_IO_CONNECTORS.pdf; Ingress Protection: -; Datasheet Version: 03/2016; Mounting Type: BoardCutout,SurfaceMount,RightAngle; Circuits: 5; Standard Package: 1; Package Reference: MICRO-B; Package URL: http://www.molex.com/pdm_docs/sd/1050170001_sd.pdf; Category: Connectors,Interconnects; Series: -; RoHS Information: 1050170001CertofCompliance; Features: Shielded,SolderRetention; Family: USB,DVI,HDMIConnectors; Specifications: -; Gender: Receptacle; Packaging: Digi-Reel®; Mounting Technology: SurfaceMount
R1-R3 = RC0402FR-075K1L: RES SMD 5.1K OHM 1% 1/16W 0402; Manufacturer: Yageo; Power Rating: 63mW; Voltage Rating: 50V; Temperature Coefficient: 100ppm/°C; Supplier 1: Digi-Key; Manufacturer Part Number: RC0402FR-075K1L; Stock 1: 0; Pricing 1: 1=0.1, 10=0.016, 100=0.0066, 1000=0.00299, 2500=0.00259, 5000=0.00214 (USD); Case/Package: 0402; Case Code (Metric): 1005; Case Code (Imperial): 0402; Min Operating Temperature: -55°C; Max Operating Temperature: 155°C; Packaging: Tape and Reel; Package Quantity: 1; Composition: Thick Film; Number of Terminations: 2; Termination: SMD/SMT; Military Standard: Not; Max Power Dissipation: 63mW; Voltage Rating (DC): 50V; Working Voltage: 50V; Features: Moisture Resistant; Length: 1mm; Height: 0.016inch; Width: 0.02inch; Depth: 0.5mm; REACH SVHC: Unknown; Lead Free: Lead Free; ComponentLink1URL: https://datasheet.ciiva.com/15189/getdatasheetpartid-323636-15189493.pdf; ComponentLink1Description: https://datasheet.ciiva.com/15189/getdatasheetpartid-323636-15189493.pdf; ComponentLink2URL: https://datasheet.ciiva.com/2453/pyu-r-int-thick-7-2453400.pdf; ComponentLink2Description: https://datasheet.ciiva.com/2453/pyu-r-int-thick-7-2453400.pdf; ComponentLink3URL: https://datasheet.ciiva.com/46394/1018594-46394936.pdf; ComponentLink3Description: https://datasheet.ciiva.com/46394/1018594-46394936.pdf; ComponentLink4URL: https://datasheet.ciiva.com/2453/pyu-r-int-thick-7-2453401.pdf; ComponentLink4Description: https://datasheet.ciiva.com/2453/pyu-r-int-thick-7-2453401.pdf; ComponentLink5URL: https://datasheet.ciiva.com/2453/pyu-r-int-thick-7-2453402.pdf; ComponentLink5Description: https://datasheet.ciiva.com/2453/pyu-r-int-thick-7-2453402.pdf; ComponentLink6URL: https://datasheet.ciiva.com/16744/pyu-rc0402-51-rohs-l-6-r-16744283.pdf; ComponentLink6Description: https://datasheet.ciiva.com/16744/pyu-rc0402-51-rohs-l-6-r-16744283.pdf; ComponentLink7URL: https://datasheet.ciiva.com/12558/pyu-rc0402-51-rohs-l-6-r-8721-12558460.pdf; ComponentLink7Description: https://datasheet.ciiva.com/12558/pyu-rc0402-51-rohs-l-6-r-8721-12558460.pdf; ComponentLink8URL: https://datasheet.ciiva.com/7983/1018594-7983519.pdf; ComponentLink8Description: https://datasheet.ciiva.com/7983/1018594-7983519.pdf; Supplier Part Number 1: 311-5.10KLRDKR-ND
R4-R6 = RC0402FR-072K2L: YAGEO (PHYCOMP)         RC0402FR-072K2L             SMD Chip Resistor, Thick Film, 2.2 kohm, 50 V, 0402 [1005 Metric], 63 mW,  1%; Power Rating: 63mW; Voltage Rating: 50V; Temperature Coefficient: 100ppm/°C; Supplier 1: Digi-Key; Manufacturer: Yageo; Manufacturer Part Number: RC0402FR-072K2L; Stock 1: 0; Pricing 1: 1=0.1, 10=0.018, 100=0.0073, 1000=0.00329, 2500=0.00286, 5000=0.00236 (USD); Case/Package: 0402; Weight: 2.3E-05oz; Case Code (Imperial): 0402; Case Code (Metric): 1005; Min Operating Temperature: -55°C; Max Operating Temperature: 155°C; Packaging: Tape and Reel; Termination: SMD/SMT; Composition: Thick Film; Military Standard: Not; Length: 1mm; Height: 0.35mm; Width: 0.5mm; Depth: 0.5mm; REACH SVHC: Unknown; Lead Free: Lead Free; ComponentLink1URL: https://datasheet.ciiva.com/11808/0900766b80c66297-11808786.pdf; ComponentLink1Description: https://datasheet.ciiva.com/11808/0900766b80c66297-11808786.pdf; ComponentLink2URL: https://datasheet.ciiva.com/12577/pyu-rc0402-51-rohs-l-6-r-12577429.pdf; ComponentLink2Description: https://datasheet.ciiva.com/12577/pyu-rc0402-51-rohs-l-6-r-12577429.pdf; ComponentLink3URL: https://datasheet.ciiva.com/16741/pyu-rc0402-51-rohs-l-6-r-16741015.pdf; ComponentLink3Description: https://datasheet.ciiva.com/16741/pyu-rc0402-51-rohs-l-6-r-16741015.pdf; ComponentLink4URL: https://datasheet.ciiva.com/7849/1018594-7849928.pdf; ComponentLink4Description: https://datasheet.ciiva.com/7849/1018594-7849928.pdf; ComponentLink5URL: https://datasheet.ciiva.com/7849/1018594-7849929.pdf; ComponentLink5Description: https://datasheet.ciiva.com/7849/1018594-7849929.pdf; ComponentLink6URL: https://datasheet.ciiva.com/7983/1018594-7983515.pdf; ComponentLink6Description: https://datasheet.ciiva.com/7983/1018594-7983515.pdf; ComponentLink7URL: https://datasheet.ciiva.com/46383/1018594-46383563.pdf; ComponentLink7Description: https://datasheet.ciiva.com/46383/1018594-46383563.pdf; Supplier Part Number 1: 311-2.20KLRDKR-ND
R7 = RC0402FR-0712KL: RES SMD 12K OHM 1% 1/16W 0402; Manufacturer: Yageo; Power Rating: 62.5mW; Voltage Rating: 50V; Max Power Dissipation: 63mW; Temperature Coefficient: 100ppm/°C; Supplier 1: Digi-Key; Manufacturer Part Number: RC0402FR-0712KL; Stock 1: 0; Pricing 1: 1=0.1, 10=0.018, 100=0.0073, 1000=0.00329, 2500=0.00286, 5000=0.00236 (USD); Case/Package: 0402; Weight: 2.3E-05oz; Case Code (Metric): 1005; Case Code (Imperial): 0402; Min Operating Temperature: -55°C; Max Operating Temperature: 155°C; Packaging: Tape and Reel; Package Quantity: 1; Composition: Thick Film; Number of Terminations: 2; Termination: SMD/SMT; Military Standard: Not; Features: Moisture Resistant; Length: 1mm; Height: 0.016inch; Width: 0.02inch; Depth: 0.5mm; REACH SVHC: No SVHC; Lead Free: Lead Free; ComponentLink1URL: https://datasheet.ciiva.com/2453/pyu-r-int-thick-7-2453379.pdf; ComponentLink1Description: https://datasheet.ciiva.com/2453/pyu-r-int-thick-7-2453379.pdf; ComponentLink2URL: https://datasheet.ciiva.com/2453/pyu-r-int-thick-7-2453380.pdf; ComponentLink2Description: https://datasheet.ciiva.com/2453/pyu-r-int-thick-7-2453380.pdf; ComponentLink3URL: https://datasheet.ciiva.com/2453/pyu-r-int-thick-7-2453381.pdf; ComponentLink3Description: https://datasheet.ciiva.com/2453/pyu-r-int-thick-7-2453381.pdf; ComponentLink4URL: https://datasheet.ciiva.com/12577/pyu-rc0402-51-rohs-l-6-r-12577269.pdf; ComponentLink4Description: https://datasheet.ciiva.com/12577/pyu-rc0402-51-rohs-l-6-r-12577269.pdf; ComponentLink5URL: https://datasheet.ciiva.com/7849/1018594-7849832.pdf; ComponentLink5Description: https://datasheet.ciiva.com/7849/1018594-7849832.pdf; ComponentLink6URL: https://datasheet.ciiva.com/7849/1018594-7849833.pdf; ComponentLink6Description: https://datasheet.ciiva.com/7849/1018594-7849833.pdf; ComponentLink7URL: https://datasheet.ciiva.com/16744/pyu-rc0402-51-rohs-l-6-r-16744492.pdf; ComponentLink7Description: https://datasheet.ciiva.com/16744/pyu-rc0402-51-rohs-l-6-r-16744492.pdf; ComponentLink8URL: https://datasheet.ciiva.com/46412/1018594-46412831.pdf; ComponentLink8Description: https://datasheet.ciiva.com/46412/1018594-46412831.pdf; Supplier Part Number 1: 311-12.0KLRDKR-ND
U2 = CMP-2000-06287-1: Dual High Speed USB to Multipurpose UART / FIFO IC / , 3 to 3.6 V, -40 to 85 degC, 64- Pin LQFP, RoHS; Manufacturer: FTDI; Number of Channels per Chip: 2; Standard Supported: RS232,RS422,RS485; Maximum Data Rate: 480Mbit/s; Package Description: 64-Pin Low-profile Quad Flat Package, Body 10 x 10 mm, Pitch 0.5 mm; Maximum Operating Temperature: +85°C; Mounting Technology: SurfaceMount; Pin Count: 64; Package Reference: LQFP-64; Manufacturer URL: http://www.nxp.com/; Length: 10mm; Width: 10mm; Minimum Operating Temperature: -40°C; Dimensions: 10x10x1.4mm; Package Type: LQFP; Mounting Type: SurfaceMount; Datasheet URL: http://www.ftdichip.com/Support/Documents/DataSheets/ICs/DS_FT2232H.pdf; Datasheet Version: Rev. 2.5, 07/2016; Height: 1.4mm; PartId: 1
U3 = 93LCS56-XSN: Imported; RefDes: RefDes; Type: DEV; Value: Value
X1 = 7M-12.000MAAJ-T: 12MHz ±30ppm Crystal 18pF 100 Ohm -20°C ~ 70°C  Surface Mount 4-SMD, No Lead (DFN, LCC); Manufacturer: TXC; ESR (Equivalent Series Resistance): 100R; Supplier 1: Digi-Key; Manufacturer Part Number: 7M-12.000MAAJ-T; Stock 1: 18420; Pricing 1: 1=1, 10=0.886, 50=0.8278, 100=0.7315, 500=0.693, 1000=0.5775 (USD); Mount: Surface Mount; Case/Package: SMD/SMT; Number of Pins: 4; Min Operating Temperature: -20°C; Max Operating Temperature: 70°C; Package Quantity: 3000; Frequency: 12MHz; Frequency Tolerance: 30ppm; Load Capacitance: 18pF; Packaging: Tape and Reel; Tolerance: 30ppm; Frequency Stability: 30ppm; Termination: SMD/SMT; Length: 3.2mm; Height: 0.031inch; Width: 0.098inch; Depth: 2.5mm; REACH SVHC: No SVHC; Lead Free: Lead Free; ComponentLink1URL: https://datasheet.ciiva.com/855/7m-855345.pdf; ComponentLink1Description: https://datasheet.ciiva.com/855/7m-855345.pdf; ComponentLink2URL: https://datasheet.ciiva.com/855/7m-855346.pdf; ComponentLink2Description: https://datasheet.ciiva.com/855/7m-855346.pdf; ComponentLink3URL: https://datasheet.ciiva.com/855/7m-855347.pdf; ComponentLink3Description: https://datasheet.ciiva.com/855/7m-855347.pdf; ComponentLink4URL: https://datasheet.ciiva.com/46431/7m-46431979.pdf; ComponentLink4Description: https://datasheet.ciiva.com/46431/7m-46431979.pdf; ComponentLink5URL: https://datasheet.ciiva.com/1356/number-crystal-basic-1356573.pdf; ComponentLink5Description: https://datasheet.ciiva.com/1356/number-crystal-basic-1356573.pdf